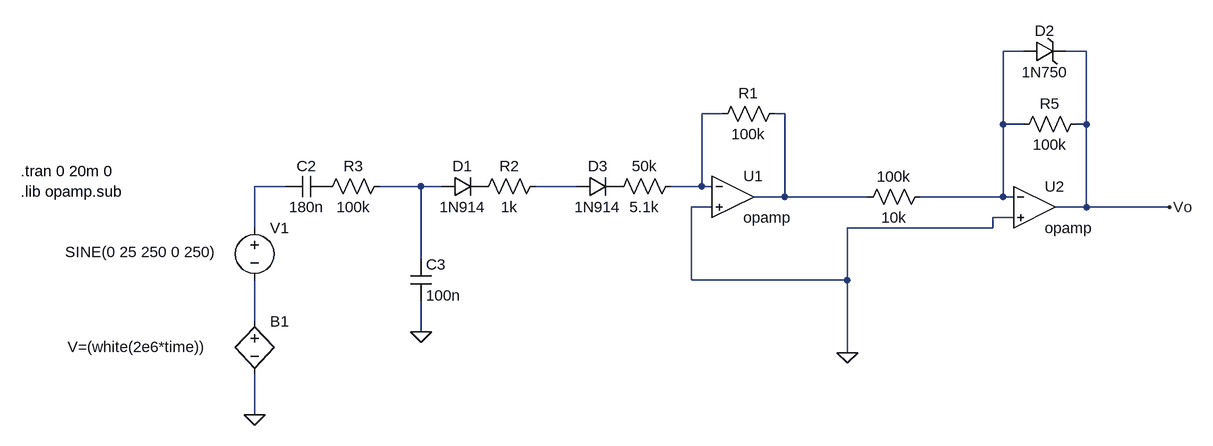
[diagram p0: schematic Pad_Damper.asc]
Pad_Damper.asc, the LTspice schematic file:
Version 4
SHEET 1 1520 680
WIRE 1248 -192 1216 -192
WIRE 1344 -192 1312 -192
WIRE 784 -96 752 -96
WIRE 880 -96 864 -96
WIRE 1216 -80 1216 -192
WIRE 1248 -80 1216 -80
WIRE 1344 -80 1344 -192
WIRE 1344 -80 1328 -80
WIRE 112 16 64 16
WIRE 320 16 256 16
WIRE 352 16 320 16
WIRE 560 16 496 16
WIRE 752 16 752 -96
WIRE 752 16 704 16
WIRE 768 16 752 16
WIRE 880 32 880 -96
WIRE 880 32 832 32
WIRE 1008 32 880 32
WIRE 1216 32 1216 -80
WIRE 1216 32 1088 32
WIRE 1232 32 1216 32
WIRE 768 48 736 48
WIRE 1344 48 1344 -80
WIRE 1344 48 1296 48
WIRE 1472 48 1344 48
WIRE 1232 64 1200 64
WIRE 64 80 64 16
WIRE 1200 80 1200 64
WIRE 1200 80 976 80
WIRE 320 128 320 16
WIRE 736 160 736 48
WIRE 976 160 976 80
WIRE 976 160 736 160
WIRE 64 224 64 160
WIRE 320 240 320 192
WIRE 976 272 976 160
WIRE 64 368 64 304
FLAG 64 368 0
FLAG 320 240 0
FLAG 1472 48 Vo
FLAG 976 272 0
SYMBOL voltage 64 64 R0
WINDOW 123 0 0 Left 0
WINDOW 39 0 0 Left 0
WINDOW 3 -292 53 Left 2
SYMATTR Value SINE(0 25 250 0 250)
SYMATTR InstName V1
SYMBOL diode 352 32 R270
WINDOW 0 32 32 VTop 2
WINDOW 3 0 32 VBottom 2
SYMATTR InstName D1
SYMATTR Value 1N914
SYMBOL OpAmps\\opamp 800 -32 R0
SYMATTR InstName U1
SYMBOL res 720 0 R90
WINDOW 0 0 56 VBottom 2
WINDOW 3 32 56 VTop 2
SYMATTR InstName 50k
SYMATTR Value 5.1k
SYMBOL res 880 -112 R90
WINDOW 0 0 56 VBottom 2
WINDOW 3 32 56 VTop 2
SYMATTR InstName R1
SYMATTR Value 100k
SYMBOL res 272 0 R90
WINDOW 0 0 56 VBottom 2
WINDOW 3 32 56 VTop 2
SYMATTR InstName R3
SYMATTR Value 100k
SYMBOL OpAmps\\opamp 1264 -16 R0
SYMATTR InstName U2
SYMBOL res 1104 16 R90
WINDOW 0 0 56 VBottom 2
WINDOW 3 32 56 VTop 2
SYMATTR InstName 100k
SYMATTR Value 10k
SYMBOL res 1344 -96 R90
WINDOW 0 0 56 VBottom 2
WINDOW 3 32 56 VTop 2
SYMATTR InstName R5
SYMATTR Value 100k
SYMBOL cap 176 0 R90
WINDOW 0 0 32 VBottom 2
WINDOW 3 32 32 VTop 2
SYMATTR InstName C2
SYMATTR Value 180n
SYMBOL diode 560 32 R270
WINDOW 0 32 32 VTop 2
WINDOW 3 0 32 VBottom 2
SYMATTR InstName D3
SYMATTR Value 1N914
SYMBOL res 512 0 R90
WINDOW 0 0 56 VBottom 2
WINDOW 3 32 56 VTop 2
SYMATTR InstName R2
SYMATTR Value 1k
SYMBOL bv 64 208 R0
WINDOW 3 -288 55 Left 2
SYMATTR Value V=(white(2e6*time))
SYMATTR InstName B1
SYMBOL cap 304 128 R0
SYMATTR InstName C3
SYMATTR Value 100n
SYMBOL zener 1248 -176 R270
WINDOW 0 32 32 VTop 2
WINDOW 3 0 32 VBottom 2
SYMATTR InstName D2
SYMATTR Value 1N750
SYMATTR Description Diode
SYMATTR Type diode
TEXT -296 -8 Left 2 !.tran 0 20m 0
TEXT -296 24 Left 2 !.lib opamp.sub

The netlist it stands for:
* Pad_Damper.asc
V1 N004 N007 SINE(0 25 250 0 250)
D1 N005 P001 1N914
XU1 N002 0 N003 opamp Aol=100K GBW=10Meg  ; pins invin noninvin out
R§50k N002 P002 5.1k
R1 N003 N002 100k
R3 N005 P003 100k
XU2 N001 0 Vo opamp Aol=100K GBW=10Meg  ; pins invin noninvin out
R§100k N001 N003 10k
R5 Vo N001 100k
C2 P003 N004 180n
D3 N006 P002 1N914
R2 N006 P001 1k
B1 N007 0 V=(white(2e6*time))
C3 N005 0 100n
D2 N001 Vo 1N750
.model D D
.lib standard.dio
.tran 0 20m 0
.lib opamp.sub
.backanno
.end